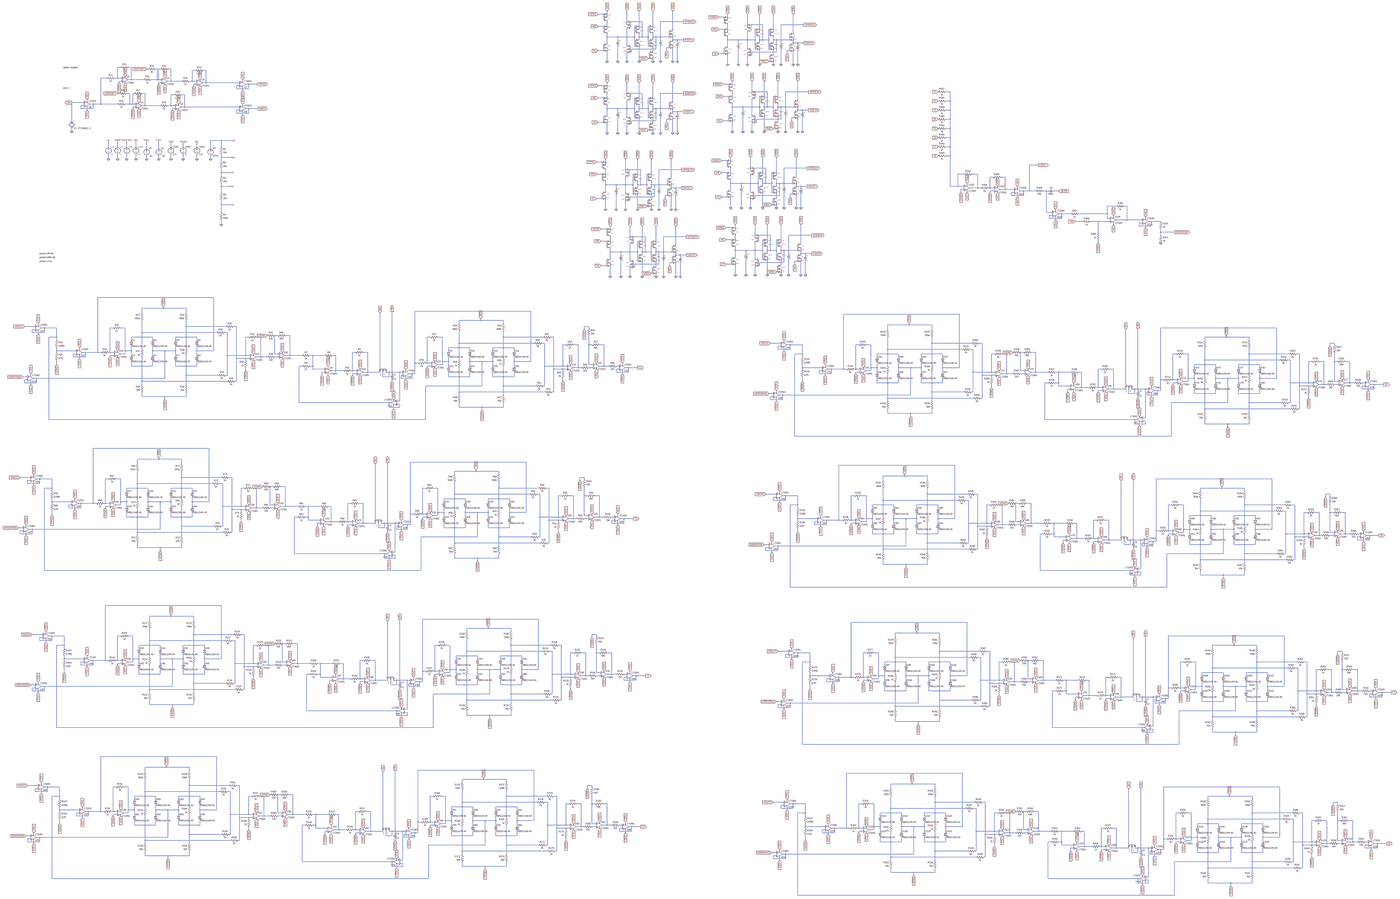
[diagram p0: schematic OZ_8_bounded_curves.asc, whole sheet]
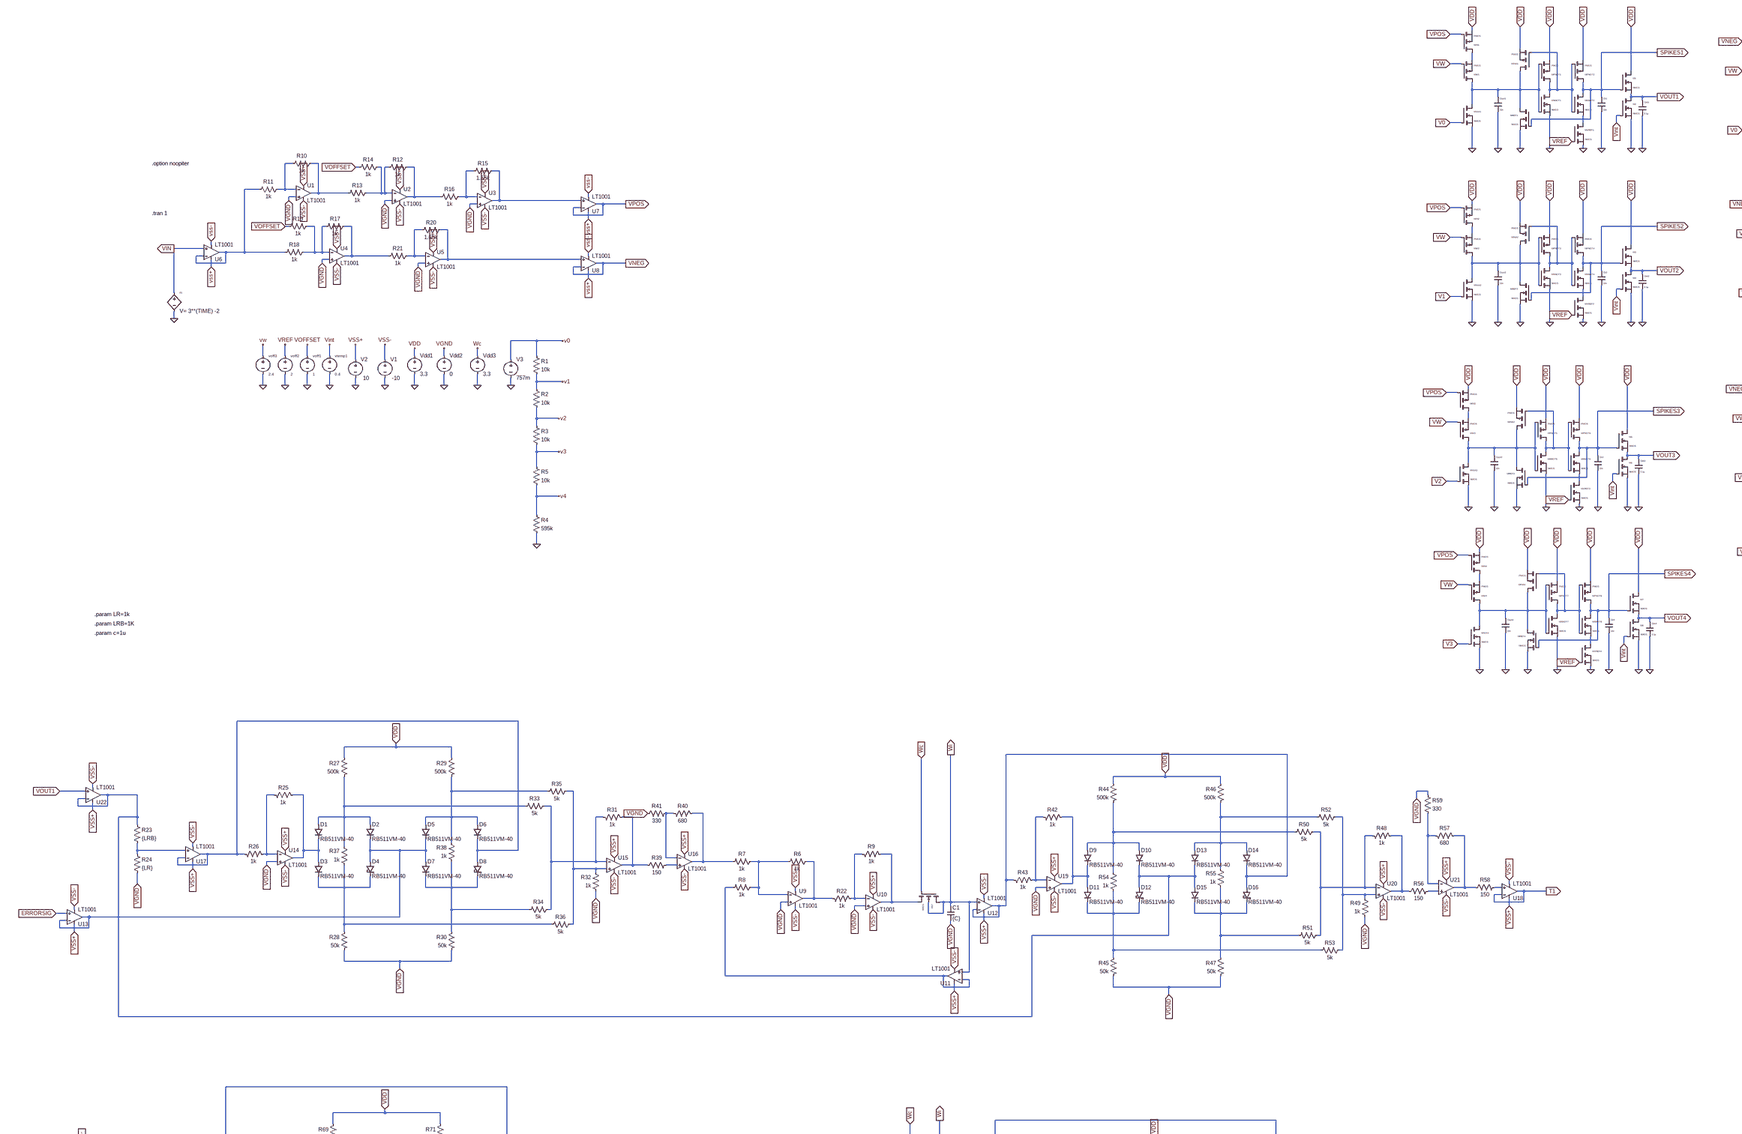
[diagram p1: schematic OZ_8_bounded_curves.asc, part, row 1 of 2, column 1 of 2]
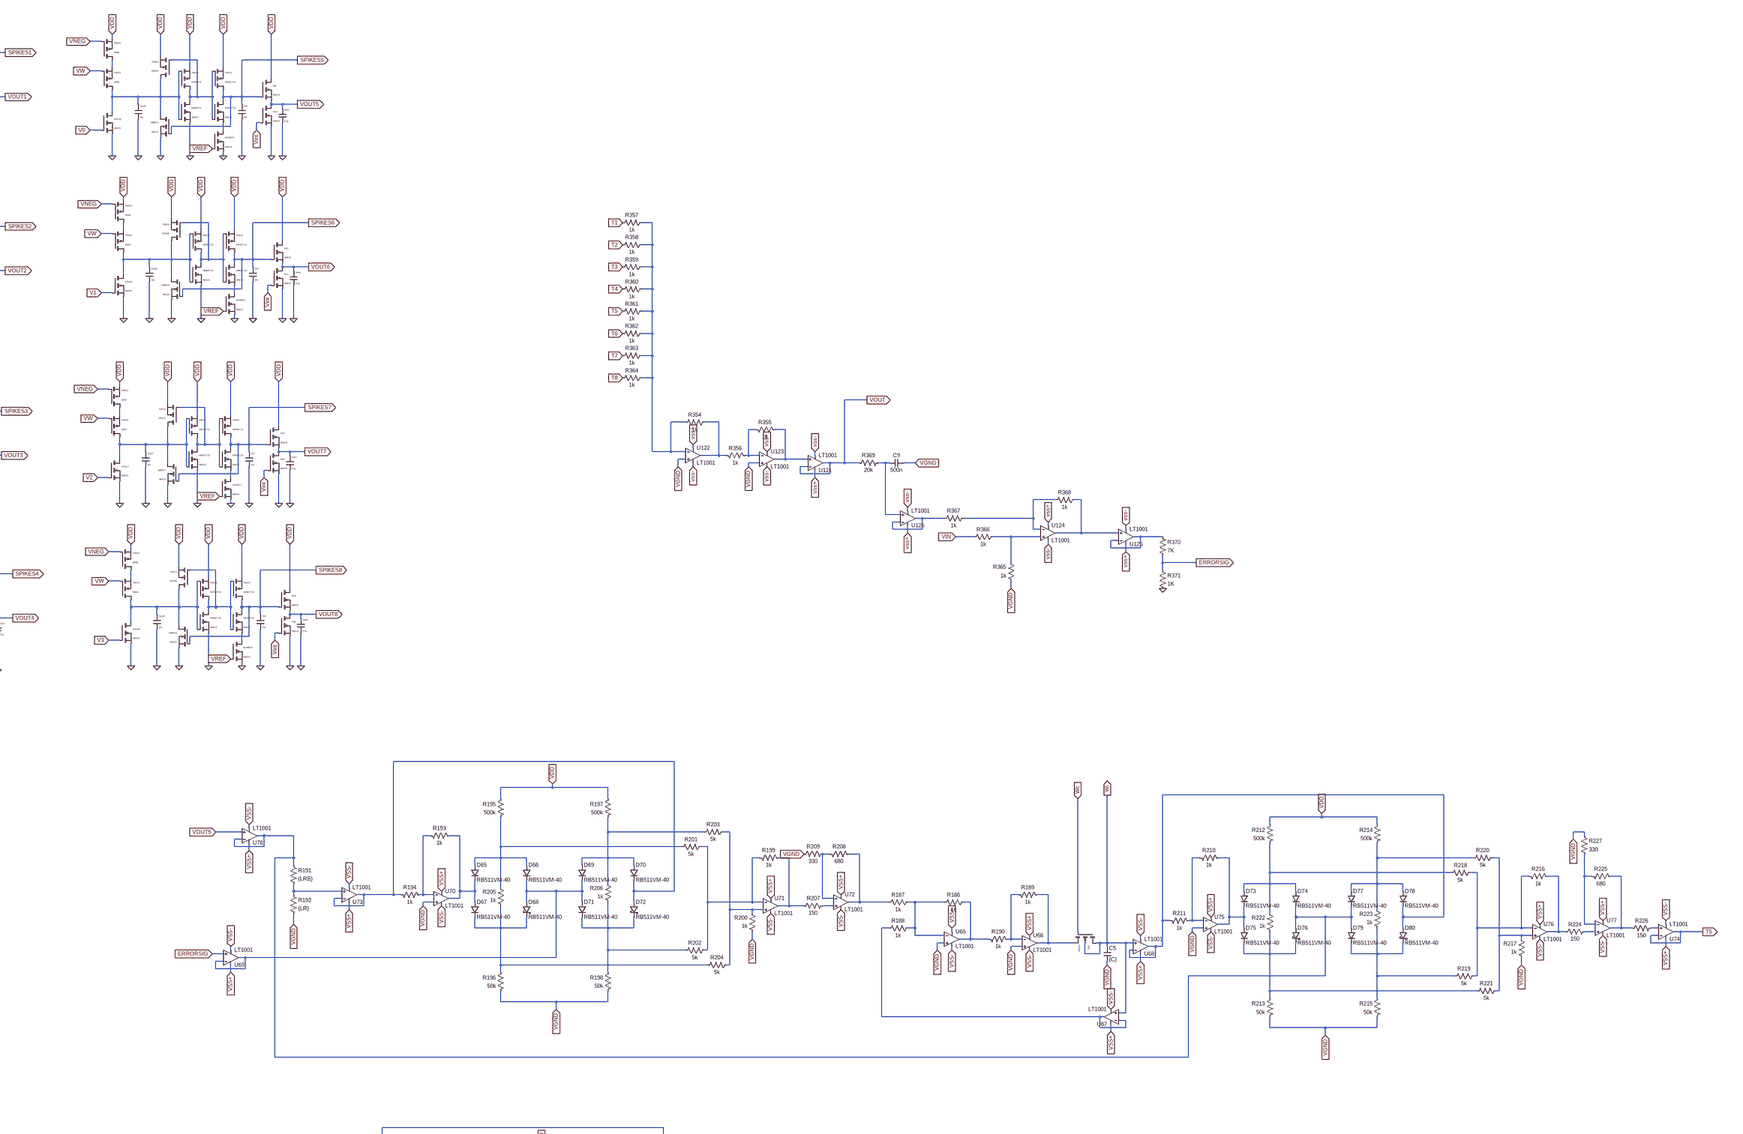
[diagram p2: schematic OZ_8_bounded_curves.asc, part, row 1 of 2, column 2 of 2]
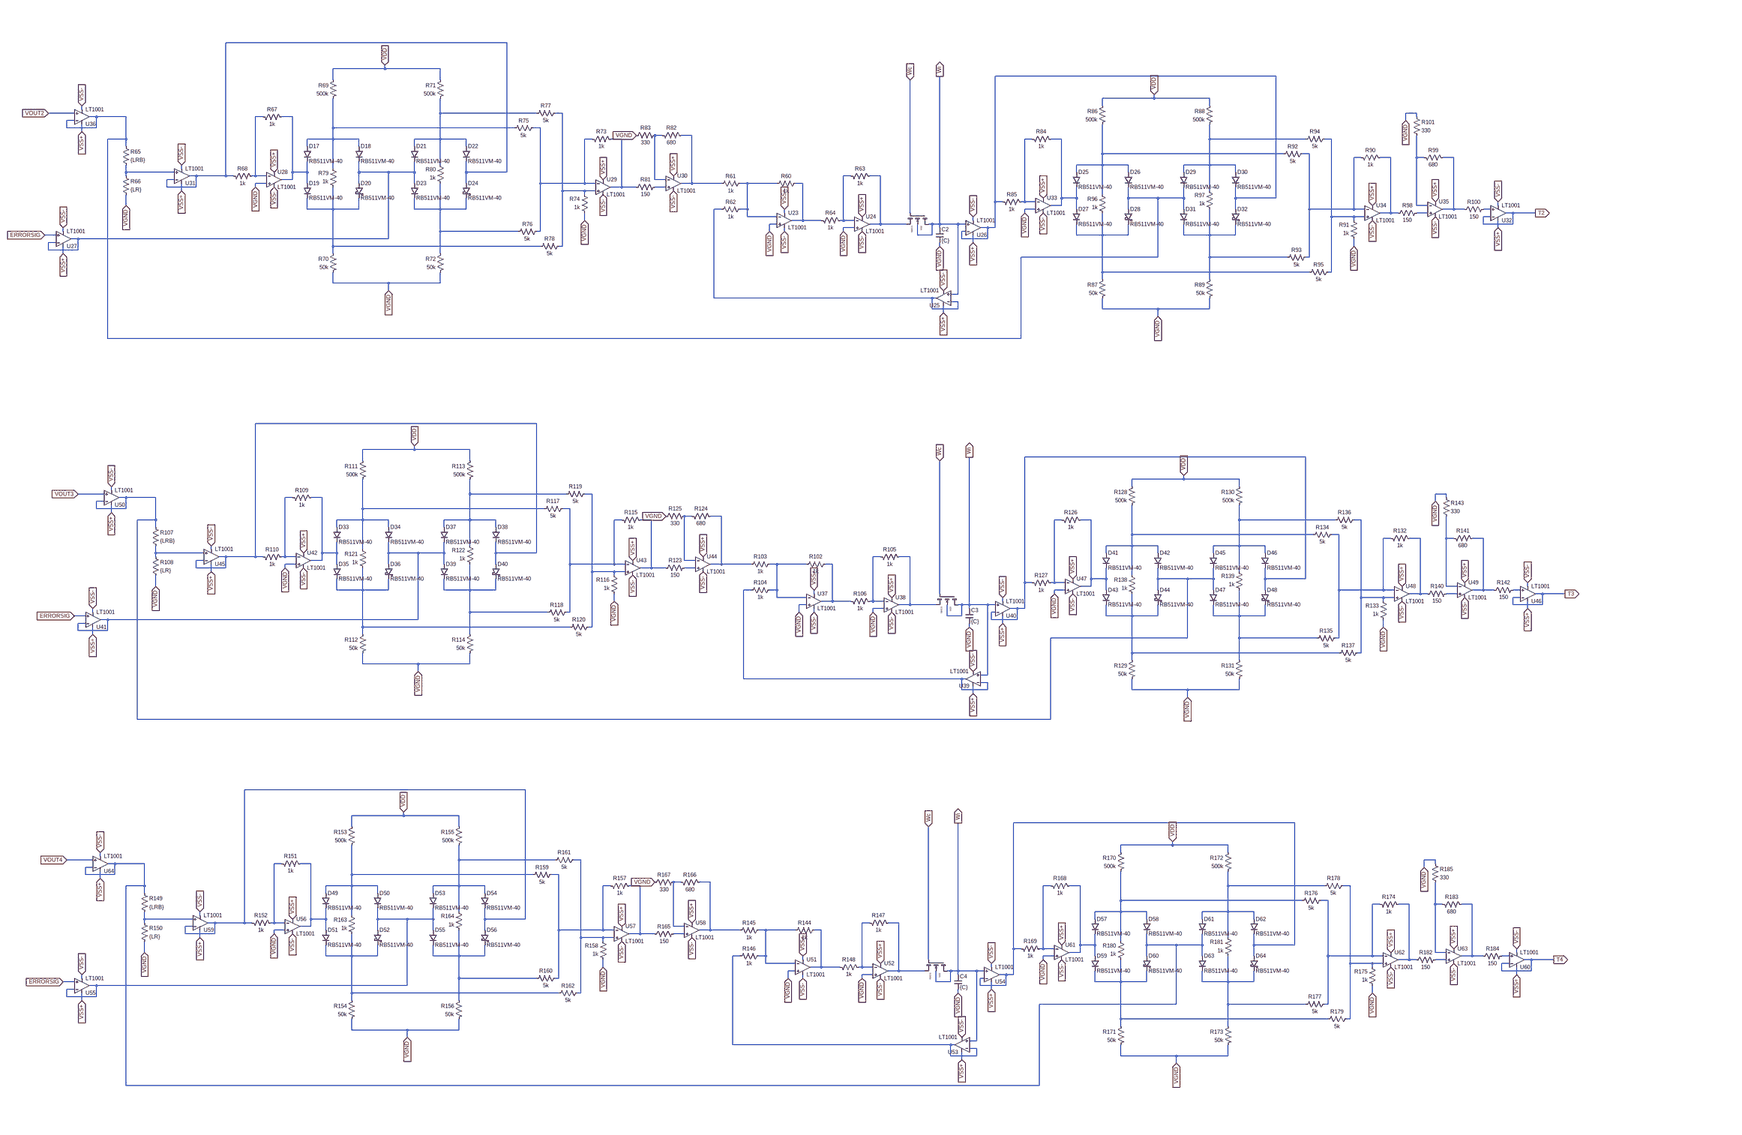
[diagram p3: schematic OZ_8_bounded_curves.asc, part, row 2 of 2, column 1 of 2]
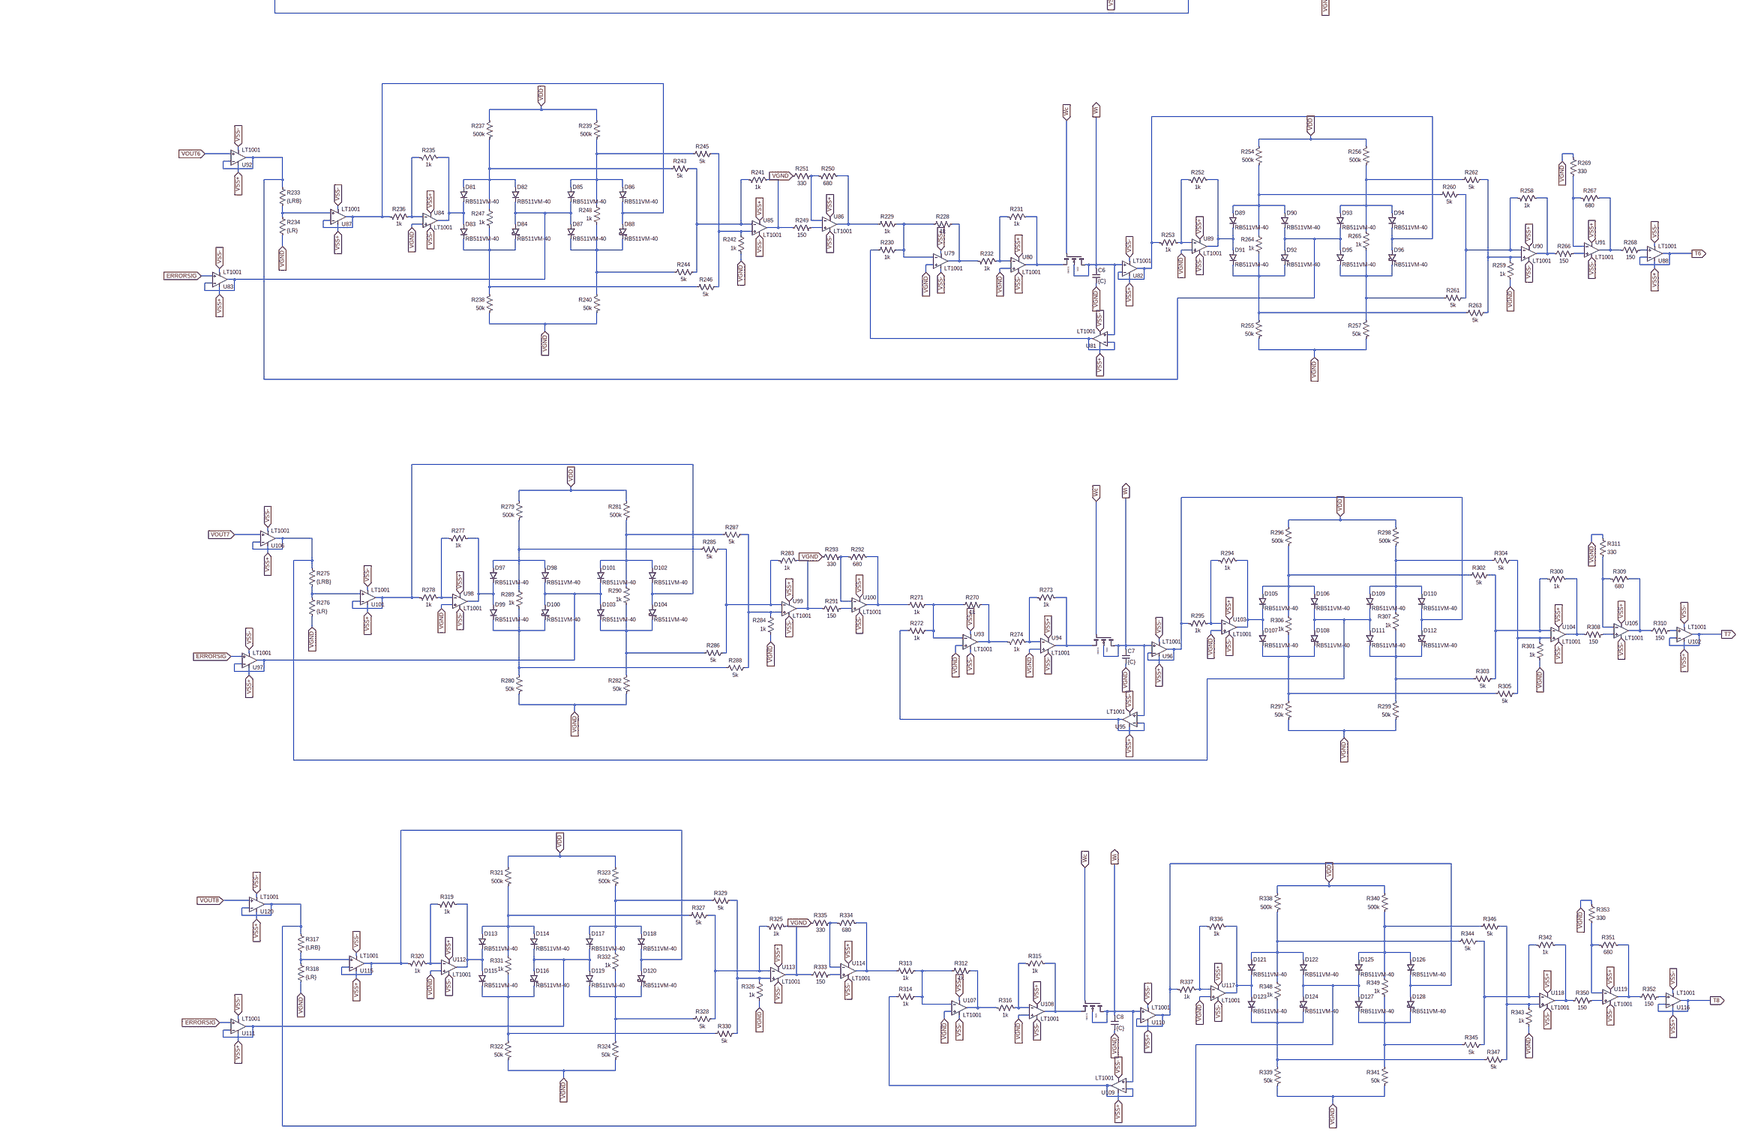
[diagram p4: schematic OZ_8_bounded_curves.asc, part, row 2 of 2, column 2 of 2]
* OZ_8_bounded_curves.asc
vtemp1 Vint 0 0.4
Vdd1 VDD 0 3.3
V1 VSS- 0 -10
V2 VSS+ 0 10
voff1 VOFFSET 0 1
voff2 VREF 0 2
voff3 vw 0 2.4
Vdd2 VGND 0 0
XU1 VGND N009 VSS+ VSS- N010 LT1001  ; pins In+ In- V+ V- OUT
R10 N010 N009 1k
R11 N009 N015 1k
XU2 VGND N011 VSS+ VSS- N012 LT1001  ; pins In+ In- V+ V- OUT
R12 N012 N011 1k
R13 N011 N010 1k
R14 N011 VOFFSET 1k
XU3 VGND N013 VSS+ VSS- N014 LT1001  ; pins In+ In- V+ V- OUT
R15 N014 N013 1.65k
R16 N013 N012 1k
XU4 VGND N018 VSS+ VSS- N019 LT1001  ; pins In+ In- V+ V- OUT
R17 N019 N018 1k
R18 N018 N015 1k
R19 N018 VOFFSET 1k
XU5 VGND N021 VSS+ VSS- N022 LT1001  ; pins In+ In- V+ V- OUT
R20 N022 N021 1.65k
R21 N021 N019 1k
XU6 VIN N015 VSS+ VSS- N015 LT1001  ; pins In+ In- V+ V- OUT
XU7 N014 VPOS VSS+ VSS- VPOS LT1001  ; pins In+ In- V+ V- OUT
XU8 N022 VNEG VSS+ VSS- VNEG LT1001  ; pins In+ In- V+ V- OUT
MW1 N005 vw N002 N002 PMOS
Csyn1 N005 0 10n V=4 Irms=162m Rser=0.395426 Lser=0 mfg="KEMET" pn="C0402C103K7PAC" type="X5R" IC=0
Ck1 SPIKES1 0 10n
MPNOT1 N001 N005 VDD VDD PMOS
MNNOT1 N001 N005 0 0 NMOS
MVREF1 N007 VREF 0 0 NMOS
MREF1 N005 SPIKES1 0 0 NMOS
MVLK1 N005 V0 0 0 NMOS
MINA1 N005 N001 VDD VDD PMOS
MIN1 N002 VPOS VDD VDD PMOS
MPNOT2 SPIKES1 N001 VDD VDD PMOS
MNNOT2 SPIKES1 N001 N007 N007 NMOS
M1 VDD SPIKES1 VOUT1 VOUT1 NMOS
M2 VOUT1 Vint 0 0 NMOS
Cint1 VOUT1 0 0.1µ
MW2 N026 vw N024 N024 PMOS
Csyn2 N026 0 10n V=4 Irms=162m Rser=0.395426 Lser=0 mfg="KEMET" pn="C0402C103K7PAC" type="X5R" IC=0
Ck2 SPIKES2 0 10n
MPNOT3 N020 N026 VDD VDD PMOS
MNNOT3 N020 N026 0 0 NMOS
MVREF2 N028 VREF 0 0 NMOS
MREF2 N026 SPIKES2 0 0 NMOS
MVLK2 N026 V1 0 0 NMOS
MINA2 N026 N020 VDD VDD PMOS
MIN2 N024 VPOS VDD VDD PMOS
MPNOT4 SPIKES2 N020 VDD VDD PMOS
MNNOT4 SPIKES2 N020 N028 N028 NMOS
M3 VDD SPIKES2 VOUT2 VOUT2 NMOS
M4 VOUT2 Vint 0 0 NMOS
Cint2 VOUT2 0 0.1µ
MW3 N037 vw N032 N032 PMOS
Csyn3 N037 0 10n V=4 Irms=162m Rser=0.395426 Lser=0 mfg="KEMET" pn="C0402C103K7PAC" type="X5R" IC=0
Ck3 SPIKES3 0 10n
MPNOT5 N030 N037 VDD VDD PMOS
MNNOT5 N030 N037 0 0 NMOS
MVREF3 N040 VREF 0 0 NMOS
MREF3 N037 SPIKES3 0 0 NMOS
MVLK3 N037 V2 0 0 NMOS
MINA3 N037 N030 VDD VDD PMOS
MIN3 N032 VPOS VDD VDD PMOS
MPNOT6 SPIKES3 N030 VDD VDD PMOS
MNNOT6 SPIKES3 N030 N040 N040 NMOS
M5 VDD SPIKES3 VOUT3 VOUT3 NMOS
M6 VOUT3 Vint 0 0 NMOS
Cint3 VOUT3 0 0.1µ
MW4 N051 vw N049 N049 PMOS
Csyn4 N051 0 10n V=4 Irms=162m Rser=0.395426 Lser=0 mfg="KEMET" pn="C0402C103K7PAC" type="X5R" IC=0
Ck4 SPIKES4 0 10n
MPNOT7 N047 N051 VDD VDD PMOS
MNNOT7 N047 N051 0 0 NMOS
MVREF4 N053 VREF 0 0 NMOS
MREF4 N051 SPIKES4 0 0 NMOS
MVLK4 N051 V3 0 0 NMOS
MINA4 N051 N047 VDD VDD PMOS
MIN4 N049 VPOS VDD VDD PMOS
MPNOT8 SPIKES4 N047 VDD VDD PMOS
MNNOT8 SPIKES4 N047 N053 N053 NMOS
M7 VDD SPIKES4 VOUT4 VOUT4 NMOS
M8 VOUT4 Vint 0 0 NMOS
Cint4 VOUT4 0 0.1µ
MW5 N006 vw N004 N004 PMOS
Csyn5 N006 0 10n V=4 Irms=162m Rser=0.395426 Lser=0 mfg="KEMET" pn="C0402C103K7PAC" type="X5R" IC=0
Ck5 SPIKES5 0 10n
MPNOT9 N003 N006 VDD VDD PMOS
MNNOT9 N003 N006 0 0 NMOS
MVREF5 N008 VREF 0 0 NMOS
MREF5 N006 SPIKES5 0 0 NMOS
MVLK5 N006 V0 0 0 NMOS
MINA5 N006 N003 VDD VDD PMOS
MIN5 N004 VNEG VDD VDD PMOS
MPNOT10 SPIKES5 N003 VDD VDD PMOS
MNNOT10 SPIKES5 N003 N008 N008 NMOS
M9 VDD SPIKES5 VOUT5 VOUT5 NMOS
M10 VOUT5 Vint 0 0 NMOS
Cint5 VOUT5 0 0.1µ
MW6 N025 vw N023 N023 PMOS
Csyn6 N025 0 10n V=4 Irms=162m Rser=0.395426 Lser=0 mfg="KEMET" pn="C0402C103K7PAC" type="X5R" IC=0
Ck6 SPIKES6 0 10n
MPNOT11 N016 N025 VDD VDD PMOS
MNNOT11 N016 N025 0 0 NMOS
MVREF6 N027 VREF 0 0 NMOS
MREF6 N025 SPIKES6 0 0 NMOS
MVLK6 N025 V1 0 0 NMOS
MINA6 N025 N016 VDD VDD PMOS
MIN6 N023 VNEG VDD VDD PMOS
MPNOT12 SPIKES6 N016 VDD VDD PMOS
MNNOT12 SPIKES6 N016 N027 N027 NMOS
M11 VDD SPIKES6 VOUT6 VOUT6 NMOS
M12 VOUT6 Vint 0 0 NMOS
Cint6 VOUT6 0 0.1µ
MW7 N036 vw N031 N031 PMOS
Csyn7 N036 0 10n V=4 Irms=162m Rser=0.395426 Lser=0 mfg="KEMET" pn="C0402C103K7PAC" type="X5R" IC=0
Ck7 SPIKES7 0 10n
MPNOT13 N029 N036 VDD VDD PMOS
MNNOT13 N029 N036 0 0 NMOS
MVREF7 N039 VREF 0 0 NMOS
MREF7 N036 SPIKES7 0 0 NMOS
MVLK7 N036 V2 0 0 NMOS
MINA7 N036 N029 VDD VDD PMOS
MIN7 N031 VNEG VDD VDD PMOS
MPNOT14 SPIKES7 N029 VDD VDD PMOS
MNNOT14 SPIKES7 N029 N039 N039 NMOS
M13 VDD SPIKES7 VOUT7 VOUT7 NMOS
M14 VOUT7 Vint 0 0 NMOS
Cint7 VOUT7 0 0.1µ
MW8 N050 vw N048 N048 PMOS
Csyn8 N050 0 10n V=4 Irms=162m Rser=0.395426 Lser=0 mfg="KEMET" pn="C0402C103K7PAC" type="X5R" IC=0
Ck8 SPIKES8 0 10n
MPNOT15 N046 N050 VDD VDD PMOS
MNNOT15 N046 N050 0 0 NMOS
MVREF8 N052 VREF 0 0 NMOS
MREF8 N050 SPIKES8 0 0 NMOS
MVLK8 N050 V3 0 0 NMOS
MINA8 N050 N046 VDD VDD PMOS
MIN8 N048 VNEG VDD VDD PMOS
MPNOT16 SPIKES8 N046 VDD VDD PMOS
MNNOT16 SPIKES8 N046 N052 N052 NMOS
M15 VDD SPIKES8 VOUT8 VOUT8 NMOS
M16 VOUT8 Vint 0 0 NMOS
Cint8 VOUT8 0 0.1µ
V3 V0 0 757m
R1 V0 V1 10k
R2 V1 V2 10k
R3 V2 V3 10k
R4 v4 0 595k
R5 V3 v4 10k
XU121 N035 VOUT VSS+ VSS- VOUT LT1001  ; pins In+ In- V+ V- OUT
XU122 VGND N017 VSS+ VSS- N033 LT1001  ; pins In+ In- V+ V- OUT
R354 N033 N017 1k
XU123 VGND N034 VSS+ VSS- N035 LT1001  ; pins In+ In- V+ V- OUT
R355 N034 N035 1k
R356 N033 N034 1k
R357 N017 T1 1k
R358 N017 T2 1k
R359 N017 T3 1k
R360 N017 T4 1k
R361 N017 T5 1k
R362 N017 T6 1k
R363 N017 T7 1k
R364 N017 T8 1k
M17 Wi Wc N087 Wi NMOS
C1 Wi VGND {C} IC=0
XU9 VGND N095 VSS+ VSS- N096 LT1001  ; pins In+ In- V+ V- OUT
R6 N096 N095 1k
R7 N095 N066 1k
R8 N095 N105 1k
XU10 VGND N086 VSS+ VSS- N087 LT1001  ; pins In+ In- V+ V- OUT
R9 N086 N087 1k
R22 N096 N086 1k
XU11 Wi N105 VSS+ VSS- N105 LT1001  ; pins In+ In- V+ V- OUT
XU12 Wi N055 VSS+ VSS- N055 LT1001  ; pins In+ In- V+ V- OUT
R23 N059 N084 {LRB}
R24 N084 VGND {LR}
XU13 ERRORSIG N085 VSS+ VSS- N085 LT1001  ; pins In+ In- V+ V- OUT
D1 N063 N061 RB511VM-40
XU14 VGND N060 VSS+ VSS- N061 LT1001  ; pins In+ In- V+ V- OUT
R25 N060 N061 1k
R26 N054 N060 1k
D2 N063 N085 RB511VM-40
D3 N061 N103 RB511VM-40
D4 N085 N103 RB511VM-40
R27 VDD N063 500k
R28 N103 VGND 50k
D5 N057 N085 RB511VM-40
D6 N057 N054 RB511VM-40
D7 N085 N104 RB511VM-40
D8 N054 N104 RB511VM-40
R29 VDD N057 500k
R30 N104 VGND 50k
XU15 N058 N064 VSS+ VSS- N067 LT1001  ; pins In+ In- V+ V- OUT
R31 N064 N067 1k
R32 VGND N058 1k
R33 N064 N063 5k
R34 N064 N104 5k
R35 N058 N057 5k
R36 N058 N103 5k
R37 N103 N063 1k
R38 N104 N057 1k
R39 N067 N097 150
XU16 N097 N065 VSS+ VSS- N066 LT1001  ; pins In+ In- V+ V- OUT
R40 N065 N066 680
R41 VGND N065 330
XU17 N084 N054 VSS+ VSS- N054 LT1001  ; pins In+ In- V+ V- OUT
XU18 N106 T1 VSS+ VSS- T1 LT1001  ; pins In+ In- V+ V- OUT
D9 N072 N069 RB511VM-40
XU19 VGND N068 VSS+ VSS- N069 LT1001  ; pins In+ In- V+ V- OUT
R42 N068 N069 1k
R43 N055 N068 1k
D10 N072 N059 RB511VM-40
D11 N069 N115 RB511VM-40
D12 N059 N115 RB511VM-40
R44 VDD N072 500k
R45 N115 VGND 50k
D13 N070 N059 RB511VM-40
D14 N070 N055 RB511VM-40
D15 N059 N116 RB511VM-40
D16 N055 N116 RB511VM-40
R46 VDD N070 500k
R47 N116 VGND 50k
XU20 N071 N073 VSS+ VSS- N076 LT1001  ; pins In+ In- V+ V- OUT
R48 N073 N076 1k
R49 VGND N071 1k
R50 N073 N072 5k
R51 N073 N116 5k
R52 N071 N070 5k
R53 N071 N115 5k
R54 N115 N072 1k
R55 N116 N070 1k
R56 N076 N107 150
XU21 N107 N077 VSS+ VSS- N078 LT1001  ; pins In+ In- V+ V- OUT
R57 N077 N078 680
R58 N078 N106 150
R59 VGND N077 330
XU22 VOUT1 N059 VSS+ VSS- N059 LT1001  ; pins In+ In- V+ V- OUT
M18 Wi Wc N157 Wi NMOS
C2 Wi VGND {C} IC=0
XU23 VGND N165 VSS+ VSS- N166 LT1001  ; pins In+ In- V+ V- OUT
R60 N166 N165 1k
R61 N165 N136 1k
R62 N165 N175 1k
XU24 VGND N156 VSS+ VSS- N157 LT1001  ; pins In+ In- V+ V- OUT
R63 N156 N157 1k
R64 N166 N156 1k
XU25 Wi N175 VSS+ VSS- N175 LT1001  ; pins In+ In- V+ V- OUT
XU26 Wi N125 VSS+ VSS- N125 LT1001  ; pins In+ In- V+ V- OUT
R65 N129 N154 {LRB}
R66 N154 VGND {LR}
XU27 ERRORSIG N155 VSS+ VSS- N155 LT1001  ; pins In+ In- V+ V- OUT
D17 N133 N131 RB511VM-40
XU28 VGND N130 VSS+ VSS- N131 LT1001  ; pins In+ In- V+ V- OUT
R67 N130 N131 1k
R68 N124 N130 1k
D18 N133 N155 RB511VM-40
D19 N131 N173 RB511VM-40
D20 N155 N173 RB511VM-40
R69 VDD N133 500k
R70 N173 VGND 50k
D21 N127 N155 RB511VM-40
D22 N127 N124 RB511VM-40
D23 N155 N174 RB511VM-40
D24 N124 N174 RB511VM-40
R71 VDD N127 500k
R72 N174 VGND 50k
XU29 N128 N134 VSS+ VSS- N137 LT1001  ; pins In+ In- V+ V- OUT
R73 N134 N137 1k
R74 VGND N128 1k
R75 N134 N133 5k
R76 N134 N174 5k
R77 N128 N127 5k
R78 N128 N173 5k
R79 N173 N133 1k
R80 N174 N127 1k
R81 N137 N167 150
XU30 N167 N135 VSS+ VSS- N136 LT1001  ; pins In+ In- V+ V- OUT
R82 N135 N136 680
R83 VGND N135 330
XU31 N154 N124 VSS+ VSS- N124 LT1001  ; pins In+ In- V+ V- OUT
XU32 N176 T2 VSS+ VSS- T2 LT1001  ; pins In+ In- V+ V- OUT
D25 N142 N139 RB511VM-40
XU33 VGND N138 VSS+ VSS- N139 LT1001  ; pins In+ In- V+ V- OUT
R84 N138 N139 1k
R85 N125 N138 1k
D26 N142 N129 RB511VM-40
D27 N139 N185 RB511VM-40
D28 N129 N185 RB511VM-40
R86 VDD N142 500k
R87 N185 VGND 50k
D29 N140 N129 RB511VM-40
D30 N140 N125 RB511VM-40
D31 N129 N186 RB511VM-40
D32 N125 N186 RB511VM-40
R88 VDD N140 500k
R89 N186 VGND 50k
XU34 N141 N143 VSS+ VSS- N146 LT1001  ; pins In+ In- V+ V- OUT
R90 N143 N146 1k
R91 VGND N141 1k
R92 N143 N142 5k
R93 N143 N186 5k
R94 N141 N140 5k
R95 N141 N185 5k
R96 N185 N142 1k
R97 N186 N140 1k
R98 N146 N177 150
XU35 N177 N147 VSS+ VSS- N148 LT1001  ; pins In+ In- V+ V- OUT
R99 N147 N148 680
R100 N148 N176 150
R101 VGND N147 330
XU36 VOUT2 N129 VSS+ VSS- N129 LT1001  ; pins In+ In- V+ V- OUT
M19 Wi Wc N227 Wi NMOS
C3 Wi VGND {C} IC=0
XU37 VGND N235 VSS+ VSS- N236 LT1001  ; pins In+ In- V+ V- OUT
R102 N236 N235 1k
R103 N235 N206 1k
R104 N235 N245 1k
XU38 VGND N226 VSS+ VSS- N227 LT1001  ; pins In+ In- V+ V- OUT
R105 N226 N227 1k
R106 N236 N226 1k
XU39 Wi N245 VSS+ VSS- N245 LT1001  ; pins In+ In- V+ V- OUT
XU40 Wi N195 VSS+ VSS- N195 LT1001  ; pins In+ In- V+ V- OUT
R107 N199 N224 {LRB}
R108 N224 VGND {LR}
XU41 ERRORSIG N225 VSS+ VSS- N225 LT1001  ; pins In+ In- V+ V- OUT
D33 N203 N201 RB511VM-40
XU42 VGND N200 VSS+ VSS- N201 LT1001  ; pins In+ In- V+ V- OUT
R109 N200 N201 1k
R110 N194 N200 1k
D34 N203 N225 RB511VM-40
D35 N201 N243 RB511VM-40
D36 N225 N243 RB511VM-40
R111 VDD N203 500k
R112 N243 VGND 50k
D37 N197 N225 RB511VM-40
D38 N197 N194 RB511VM-40
D39 N225 N244 RB511VM-40
D40 N194 N244 RB511VM-40
R113 VDD N197 500k
R114 N244 VGND 50k
XU43 N198 N204 VSS+ VSS- N207 LT1001  ; pins In+ In- V+ V- OUT
R115 N204 N207 1k
R116 VGND N198 1k
R117 N204 N203 5k
R118 N204 N244 5k
R119 N198 N197 5k
R120 N198 N243 5k
R121 N243 N203 1k
R122 N244 N197 1k
R123 N207 N237 150
XU44 N237 N205 VSS+ VSS- N206 LT1001  ; pins In+ In- V+ V- OUT
R124 N205 N206 680
R125 VGND N205 330
XU45 N224 N194 VSS+ VSS- N194 LT1001  ; pins In+ In- V+ V- OUT
XU46 N246 T3 VSS+ VSS- T3 LT1001  ; pins In+ In- V+ V- OUT
D41 N212 N209 RB511VM-40
XU47 VGND N208 VSS+ VSS- N209 LT1001  ; pins In+ In- V+ V- OUT
R126 N208 N209 1k
R127 N195 N208 1k
D42 N212 N199 RB511VM-40
D43 N209 N255 RB511VM-40
D44 N199 N255 RB511VM-40
R128 VDD N212 500k
R129 N255 VGND 50k
D45 N210 N199 RB511VM-40
D46 N210 N195 RB511VM-40
D47 N199 N256 RB511VM-40
D48 N195 N256 RB511VM-40
R130 VDD N210 500k
R131 N256 VGND 50k
XU48 N211 N213 VSS+ VSS- N216 LT1001  ; pins In+ In- V+ V- OUT
R132 N213 N216 1k
R133 VGND N211 1k
R134 N213 N212 5k
R135 N213 N256 5k
R136 N211 N210 5k
R137 N211 N255 5k
R138 N255 N212 1k
R139 N256 N210 1k
R140 N216 N247 150
XU49 N247 N217 VSS+ VSS- N218 LT1001  ; pins In+ In- V+ V- OUT
R141 N217 N218 680
R142 N218 N246 150
R143 VGND N217 330
XU50 VOUT3 N199 VSS+ VSS- N199 LT1001  ; pins In+ In- V+ V- OUT
M20 Wi Wc N297 Wi NMOS
C4 Wi VGND {C} IC=0
XU51 VGND N305 VSS+ VSS- N306 LT1001  ; pins In+ In- V+ V- OUT
R144 N306 N305 1k
R145 N305 N276 1k
R146 N305 N315 1k
XU52 VGND N296 VSS+ VSS- N297 LT1001  ; pins In+ In- V+ V- OUT
R147 N296 N297 1k
R148 N306 N296 1k
XU53 Wi N315 VSS+ VSS- N315 LT1001  ; pins In+ In- V+ V- OUT
XU54 Wi N265 VSS+ VSS- N265 LT1001  ; pins In+ In- V+ V- OUT
R149 N269 N294 {LRB}
R150 N294 VGND {LR}
XU55 ERRORSIG N295 VSS+ VSS- N295 LT1001  ; pins In+ In- V+ V- OUT
D49 N273 N271 RB511VM-40
XU56 VGND N270 VSS+ VSS- N271 LT1001  ; pins In+ In- V+ V- OUT
R151 N270 N271 1k
R152 N264 N270 1k
D50 N273 N295 RB511VM-40
D51 N271 N313 RB511VM-40
D52 N295 N313 RB511VM-40
R153 VDD N273 500k
R154 N313 VGND 50k
D53 N267 N295 RB511VM-40
D54 N267 N264 RB511VM-40
D55 N295 N314 RB511VM-40
D56 N264 N314 RB511VM-40
R155 VDD N267 500k
R156 N314 VGND 50k
XU57 N268 N274 VSS+ VSS- N277 LT1001  ; pins In+ In- V+ V- OUT
R157 N274 N277 1k
R158 VGND N268 1k
R159 N274 N273 5k
R160 N274 N314 5k
R161 N268 N267 5k
R162 N268 N313 5k
R163 N313 N273 1k
R164 N314 N267 1k
R165 N277 N307 150
XU58 N307 N275 VSS+ VSS- N276 LT1001  ; pins In+ In- V+ V- OUT
R166 N275 N276 680
R167 VGND N275 330
XU59 N294 N264 VSS+ VSS- N264 LT1001  ; pins In+ In- V+ V- OUT
XU60 N316 T4 VSS+ VSS- T4 LT1001  ; pins In+ In- V+ V- OUT
D57 N282 N279 RB511VM-40
XU61 VGND N278 VSS+ VSS- N279 LT1001  ; pins In+ In- V+ V- OUT
R168 N278 N279 1k
R169 N265 N278 1k
D58 N282 N269 RB511VM-40
D59 N279 N325 RB511VM-40
D60 N269 N325 RB511VM-40
R170 VDD N282 500k
R171 N325 VGND 50k
D61 N280 N269 RB511VM-40
D62 N280 N265 RB511VM-40
D63 N269 N326 RB511VM-40
D64 N265 N326 RB511VM-40
R172 VDD N280 500k
R173 N326 VGND 50k
XU62 N281 N283 VSS+ VSS- N286 LT1001  ; pins In+ In- V+ V- OUT
R174 N283 N286 1k
R175 VGND N281 1k
R176 N283 N282 5k
R177 N283 N326 5k
R178 N281 N280 5k
R179 N281 N325 5k
R180 N325 N282 1k
R181 N326 N280 1k
R182 N286 N317 150
XU63 N317 N287 VSS+ VSS- N288 LT1001  ; pins In+ In- V+ V- OUT
R183 N287 N288 680
R184 N288 N316 150
R185 VGND N287 330
XU64 VOUT4 N269 VSS+ VSS- N269 LT1001  ; pins In+ In- V+ V- OUT
M21 Wi Wc N111 Wi NMOS
C5 Wi VGND {C} IC=0
XU65 VGND N112 VSS+ VSS- N113 LT1001  ; pins In+ In- V+ V- OUT
R186 N113 N112 1k
R187 N112 N089 1k
R188 N112 N119 1k
XU66 VGND N110 VSS+ VSS- N111 LT1001  ; pins In+ In- V+ V- OUT
R189 N110 N111 1k
R190 N113 N110 1k
XU67 Wi N119 VSS+ VSS- N119 LT1001  ; pins In+ In- V+ V- OUT
XU68 Wi N062 VSS+ VSS- N062 LT1001  ; pins In+ In- V+ V- OUT
R191 N079 N108 {LRB}
R192 N108 VGND {LR}
XU69 ERRORSIG N109 VSS+ VSS- N109 LT1001  ; pins In+ In- V+ V- OUT
D65 N082 N081 RB511VM-40
XU70 VGND N080 VSS+ VSS- N081 LT1001  ; pins In+ In- V+ V- OUT
R193 N080 N081 1k
R194 N056 N080 1k
D66 N082 N109 RB511VM-40
D67 N081 N117 RB511VM-40
D68 N109 N117 RB511VM-40
R195 VDD N082 500k
R196 N117 VGND 50k
D69 N074 N109 RB511VM-40
D70 N074 N056 RB511VM-40
D71 N109 N118 RB511VM-40
D72 N056 N118 RB511VM-40
R197 VDD N074 500k
R198 N118 VGND 50k
XU71 N075 N083 VSS+ VSS- N090 LT1001  ; pins In+ In- V+ V- OUT
R199 N083 N090 1k
R200 VGND N075 1k
R201 N083 N082 5k
R202 N083 N118 5k
R203 N075 N074 5k
R204 N075 N117 5k
R205 N117 N082 1k
R206 N118 N074 1k
R207 N090 N114 150
XU72 N114 N088 VSS+ VSS- N089 LT1001  ; pins In+ In- V+ V- OUT
R208 N088 N089 680
R209 VGND N088 330
XU73 N108 N056 VSS+ VSS- N056 LT1001  ; pins In+ In- V+ V- OUT
XU74 N120 T5 VSS+ VSS- T5 LT1001  ; pins In+ In- V+ V- OUT
D73 N098 N092 RB511VM-40
XU75 VGND N091 VSS+ VSS- N092 LT1001  ; pins In+ In- V+ V- OUT
R210 N091 N092 1k
R211 N062 N091 1k
D74 N098 N079 RB511VM-40
D75 N092 N122 RB511VM-40
D76 N079 N122 RB511VM-40
R212 VDD N098 500k
R213 N122 VGND 50k
D77 N093 N079 RB511VM-40
D78 N093 N062 RB511VM-40
D79 N079 N123 RB511VM-40
D80 N062 N123 RB511VM-40
R214 VDD N093 500k
R215 N123 VGND 50k
XU76 N094 N099 VSS+ VSS- N100 LT1001  ; pins In+ In- V+ V- OUT
R216 N099 N100 1k
R217 VGND N094 1k
R218 N099 N098 5k
R219 N099 N123 5k
R220 N094 N093 5k
R221 N094 N122 5k
R222 N122 N098 1k
R223 N123 N093 1k
R224 N100 N121 150
XU77 N121 N101 VSS+ VSS- N102 LT1001  ; pins In+ In- V+ V- OUT
R225 N101 N102 680
R226 N102 N120 150
R227 VGND N101 330
XU78 VOUT5 N079 VSS+ VSS- N079 LT1001  ; pins In+ In- V+ V- OUT
M22 Wi Wc N181 Wi NMOS
C6 Wi VGND {C} IC=0
XU79 VGND N182 VSS+ VSS- N183 LT1001  ; pins In+ In- V+ V- OUT
R228 N183 N182 1k
R229 N182 N159 1k
R230 N182 N189 1k
XU80 VGND N180 VSS+ VSS- N181 LT1001  ; pins In+ In- V+ V- OUT
R231 N180 N181 1k
R232 N183 N180 1k
XU81 Wi N189 VSS+ VSS- N189 LT1001  ; pins In+ In- V+ V- OUT
XU82 Wi N132 VSS+ VSS- N132 LT1001  ; pins In+ In- V+ V- OUT
R233 N149 N178 {LRB}
R234 N178 VGND {LR}
XU83 ERRORSIG N179 VSS+ VSS- N179 LT1001  ; pins In+ In- V+ V- OUT
D81 N152 N151 RB511VM-40
XU84 VGND N150 VSS+ VSS- N151 LT1001  ; pins In+ In- V+ V- OUT
R235 N150 N151 1k
R236 N126 N150 1k
D82 N152 N179 RB511VM-40
D83 N151 N187 RB511VM-40
D84 N179 N187 RB511VM-40
R237 VDD N152 500k
R238 N187 VGND 50k
D85 N144 N179 RB511VM-40
D86 N144 N126 RB511VM-40
D87 N179 N188 RB511VM-40
D88 N126 N188 RB511VM-40
R239 VDD N144 500k
R240 N188 VGND 50k
XU85 N145 N153 VSS+ VSS- N160 LT1001  ; pins In+ In- V+ V- OUT
R241 N153 N160 1k
R242 VGND N145 1k
R243 N153 N152 5k
R244 N153 N188 5k
R245 N145 N144 5k
R246 N145 N187 5k
R247 N187 N152 1k
R248 N188 N144 1k
R249 N160 N184 150
XU86 N184 N158 VSS+ VSS- N159 LT1001  ; pins In+ In- V+ V- OUT
R250 N158 N159 680
R251 VGND N158 330
XU87 N178 N126 VSS+ VSS- N126 LT1001  ; pins In+ In- V+ V- OUT
XU88 N190 T6 VSS+ VSS- T6 LT1001  ; pins In+ In- V+ V- OUT
D89 N168 N162 RB511VM-40
XU89 VGND N161 VSS+ VSS- N162 LT1001  ; pins In+ In- V+ V- OUT
R252 N161 N162 1k
R253 N132 N161 1k
D90 N168 N149 RB511VM-40
D91 N162 N192 RB511VM-40
D92 N149 N192 RB511VM-40
R254 VDD N168 500k
R255 N192 VGND 50k
D93 N163 N149 RB511VM-40
D94 N163 N132 RB511VM-40
D95 N149 N193 RB511VM-40
D96 N132 N193 RB511VM-40
R256 VDD N163 500k
R257 N193 VGND 50k
XU90 N164 N169 VSS+ VSS- N170 LT1001  ; pins In+ In- V+ V- OUT
R258 N169 N170 1k
R259 VGND N164 1k
R260 N169 N168 5k
R261 N169 N193 5k
R262 N164 N163 5k
R263 N164 N192 5k
R264 N192 N168 1k
R265 N193 N163 1k
R266 N170 N191 150
XU91 N191 N171 VSS+ VSS- N172 LT1001  ; pins In+ In- V+ V- OUT
R267 N171 N172 680
R268 N172 N190 150
R269 VGND N171 330
XU92 VOUT6 N149 VSS+ VSS- N149 LT1001  ; pins In+ In- V+ V- OUT
M23 Wi Wc N251 Wi NMOS
C7 Wi VGND {C} IC=0
XU93 VGND N252 VSS+ VSS- N253 LT1001  ; pins In+ In- V+ V- OUT
R270 N253 N252 1k
R271 N252 N229 1k
R272 N252 N259 1k
XU94 VGND N250 VSS+ VSS- N251 LT1001  ; pins In+ In- V+ V- OUT
R273 N250 N251 1k
R274 N253 N250 1k
XU95 Wi N259 VSS+ VSS- N259 LT1001  ; pins In+ In- V+ V- OUT
XU96 Wi N202 VSS+ VSS- N202 LT1001  ; pins In+ In- V+ V- OUT
R275 N219 N248 {LRB}
R276 N248 VGND {LR}
XU97 ERRORSIG N249 VSS+ VSS- N249 LT1001  ; pins In+ In- V+ V- OUT
D97 N222 N221 RB511VM-40
XU98 VGND N220 VSS+ VSS- N221 LT1001  ; pins In+ In- V+ V- OUT
R277 N220 N221 1k
R278 N196 N220 1k
D98 N222 N249 RB511VM-40
D99 N221 N257 RB511VM-40
D100 N249 N257 RB511VM-40
R279 VDD N222 500k
R280 N257 VGND 50k
D101 N214 N249 RB511VM-40
D102 N214 N196 RB511VM-40
D103 N249 N258 RB511VM-40
D104 N196 N258 RB511VM-40
R281 VDD N214 500k
R282 N258 VGND 50k
XU99 N215 N223 VSS+ VSS- N230 LT1001  ; pins In+ In- V+ V- OUT
R283 N223 N230 1k
R284 VGND N215 1k
R285 N223 N222 5k
R286 N223 N258 5k
R287 N215 N214 5k
R288 N215 N257 5k
R289 N257 N222 1k
R290 N258 N214 1k
R291 N230 N254 150
XU100 N254 N228 VSS+ VSS- N229 LT1001  ; pins In+ In- V+ V- OUT
R292 N228 N229 680
R293 VGND N228 330
XU101 N248 N196 VSS+ VSS- N196 LT1001  ; pins In+ In- V+ V- OUT
XU102 N260 T7 VSS+ VSS- T7 LT1001  ; pins In+ In- V+ V- OUT
D105 N238 N232 RB511VM-40
XU103 VGND N231 VSS+ VSS- N232 LT1001  ; pins In+ In- V+ V- OUT
R294 N231 N232 1k
R295 N202 N231 1k
D106 N238 N219 RB511VM-40
D107 N232 N262 RB511VM-40
D108 N219 N262 RB511VM-40
R296 VDD N238 500k
R297 N262 VGND 50k
D109 N233 N219 RB511VM-40
D110 N233 N202 RB511VM-40
D111 N219 N263 RB511VM-40
D112 N202 N263 RB511VM-40
R298 VDD N233 500k
R299 N263 VGND 50k
XU104 N234 N239 VSS+ VSS- N240 LT1001  ; pins In+ In- V+ V- OUT
R300 N239 N240 1k
R301 VGND N234 1k
R302 N239 N238 5k
R303 N239 N263 5k
R304 N234 N233 5k
R305 N234 N262 5k
R306 N262 N238 1k
R307 N263 N233 1k
R308 N240 N261 150
XU105 N261 N241 VSS+ VSS- N242 LT1001  ; pins In+ In- V+ V- OUT
R309 N241 N242 680
R310 N242 N260 150
R311 VGND N241 330
XU106 VOUT7 N219 VSS+ VSS- N219 LT1001  ; pins In+ In- V+ V- OUT
M24 Wi Wc N321 Wi NMOS
C8 Wi VGND {C} IC=0
XU107 VGND N322 VSS+ VSS- N323 LT1001  ; pins In+ In- V+ V- OUT
R312 N323 N322 1k
R313 N322 N299 1k
R314 N322 N329 1k
XU108 VGND N320 VSS+ VSS- N321 LT1001  ; pins In+ In- V+ V- OUT
R315 N320 N321 1k
R316 N323 N320 1k
XU109 Wi N329 VSS+ VSS- N329 LT1001  ; pins In+ In- V+ V- OUT
XU110 Wi N272 VSS+ VSS- N272 LT1001  ; pins In+ In- V+ V- OUT
R317 N289 N318 {LRB}
R318 N318 VGND {LR}
XU111 ERRORSIG N319 VSS+ VSS- N319 LT1001  ; pins In+ In- V+ V- OUT
D113 N292 N291 RB511VM-40
XU112 VGND N290 VSS+ VSS- N291 LT1001  ; pins In+ In- V+ V- OUT
R319 N290 N291 1k
R320 N266 N290 1k
D114 N292 N319 RB511VM-40
D115 N291 N327 RB511VM-40
D116 N319 N327 RB511VM-40
R321 VDD N292 500k
R322 N327 VGND 50k
D117 N284 N319 RB511VM-40
D118 N284 N266 RB511VM-40
D119 N319 N328 RB511VM-40
D120 N266 N328 RB511VM-40
R323 VDD N284 500k
R324 N328 VGND 50k
XU113 N285 N293 VSS+ VSS- N300 LT1001  ; pins In+ In- V+ V- OUT
R325 N293 N300 1k
R326 VGND N285 1k
R327 N293 N292 5k
R328 N293 N328 5k
R329 N285 N284 5k
R330 N285 N327 5k
R331 N327 N292 1k
R332 N328 N284 1k
R333 N300 N324 150
XU114 N324 N298 VSS+ VSS- N299 LT1001  ; pins In+ In- V+ V- OUT
R334 N298 N299 680
R335 VGND N298 330
XU115 N318 N266 VSS+ VSS- N266 LT1001  ; pins In+ In- V+ V- OUT
XU116 N330 T8 VSS+ VSS- T8 LT1001  ; pins In+ In- V+ V- OUT
D121 N308 N302 RB511VM-40
XU117 VGND N301 VSS+ VSS- N302 LT1001  ; pins In+ In- V+ V- OUT
R336 N301 N302 1k
R337 N272 N301 1k
D122 N308 N289 RB511VM-40
D123 N302 N332 RB511VM-40
D124 N289 N332 RB511VM-40
R338 VDD N308 500k
R339 N332 VGND 50k
D125 N303 N289 RB511VM-40
D126 N303 N272 RB511VM-40
D127 N289 N333 RB511VM-40
D128 N272 N333 RB511VM-40
R340 VDD N303 500k
R341 N333 VGND 50k
XU118 N304 N309 VSS+ VSS- N310 LT1001  ; pins In+ In- V+ V- OUT
R342 N309 N310 1k
R343 VGND N304 1k
R344 N309 N308 5k
R345 N309 N333 5k
R346 N304 N303 5k
R347 N304 N332 5k
R348 N332 N308 1k
R349 N333 N303 1k
R350 N310 N331 150
XU119 N331 N311 VSS+ VSS- N312 LT1001  ; pins In+ In- V+ V- OUT
R351 N311 N312 680
R352 N312 N330 150
R353 VGND N311 330
XU120 VOUT8 N289 VSS+ VSS- N289 LT1001  ; pins In+ In- V+ V- OUT
XU124 N044 N041 VSS+ VSS- N042 LT1001  ; pins In+ In- V+ V- OUT
R365 VGND N044 1k
R366 N044 VIN 1k
R367 N041 N043 1k
R368 N042 N041 1k
XU125 N042 N045 VSS+ VSS- N045 LT1001  ; pins In+ In- V+ V- OUT
R369 VOUT N038 20k
C9 N038 VGND 500n
XU126 N038 N043 VSS+ VSS- N043 LT1001  ; pins In+ In- V+ V- OUT
R370 N045 ERRORSIG 7K
R371 ERRORSIG 0 1K
Vdd3 Wc 0 3.3
B1 VIN 0 V= 3**(TIME) -2
.model D D
.lib standard.dio
.model NMOS NMOS
.model PMOS PMOS
.lib standard.mos
.tran 1
.option noopiter
.param LR=1k
.param LRB=1K
.param c=1u
.lib LTC.lib
.backanno
.end